# Altium schematic sheet FPGA_GTXs.SchDoc: FPGA GTX Transceivers & SFP Clock
size B; CheckedBy: Jason Sullins; Author: Jordan Harris-Toovy; Revision: 0.2; SheetNumber: 20; SheetTotal: 22; Size: ANSI B
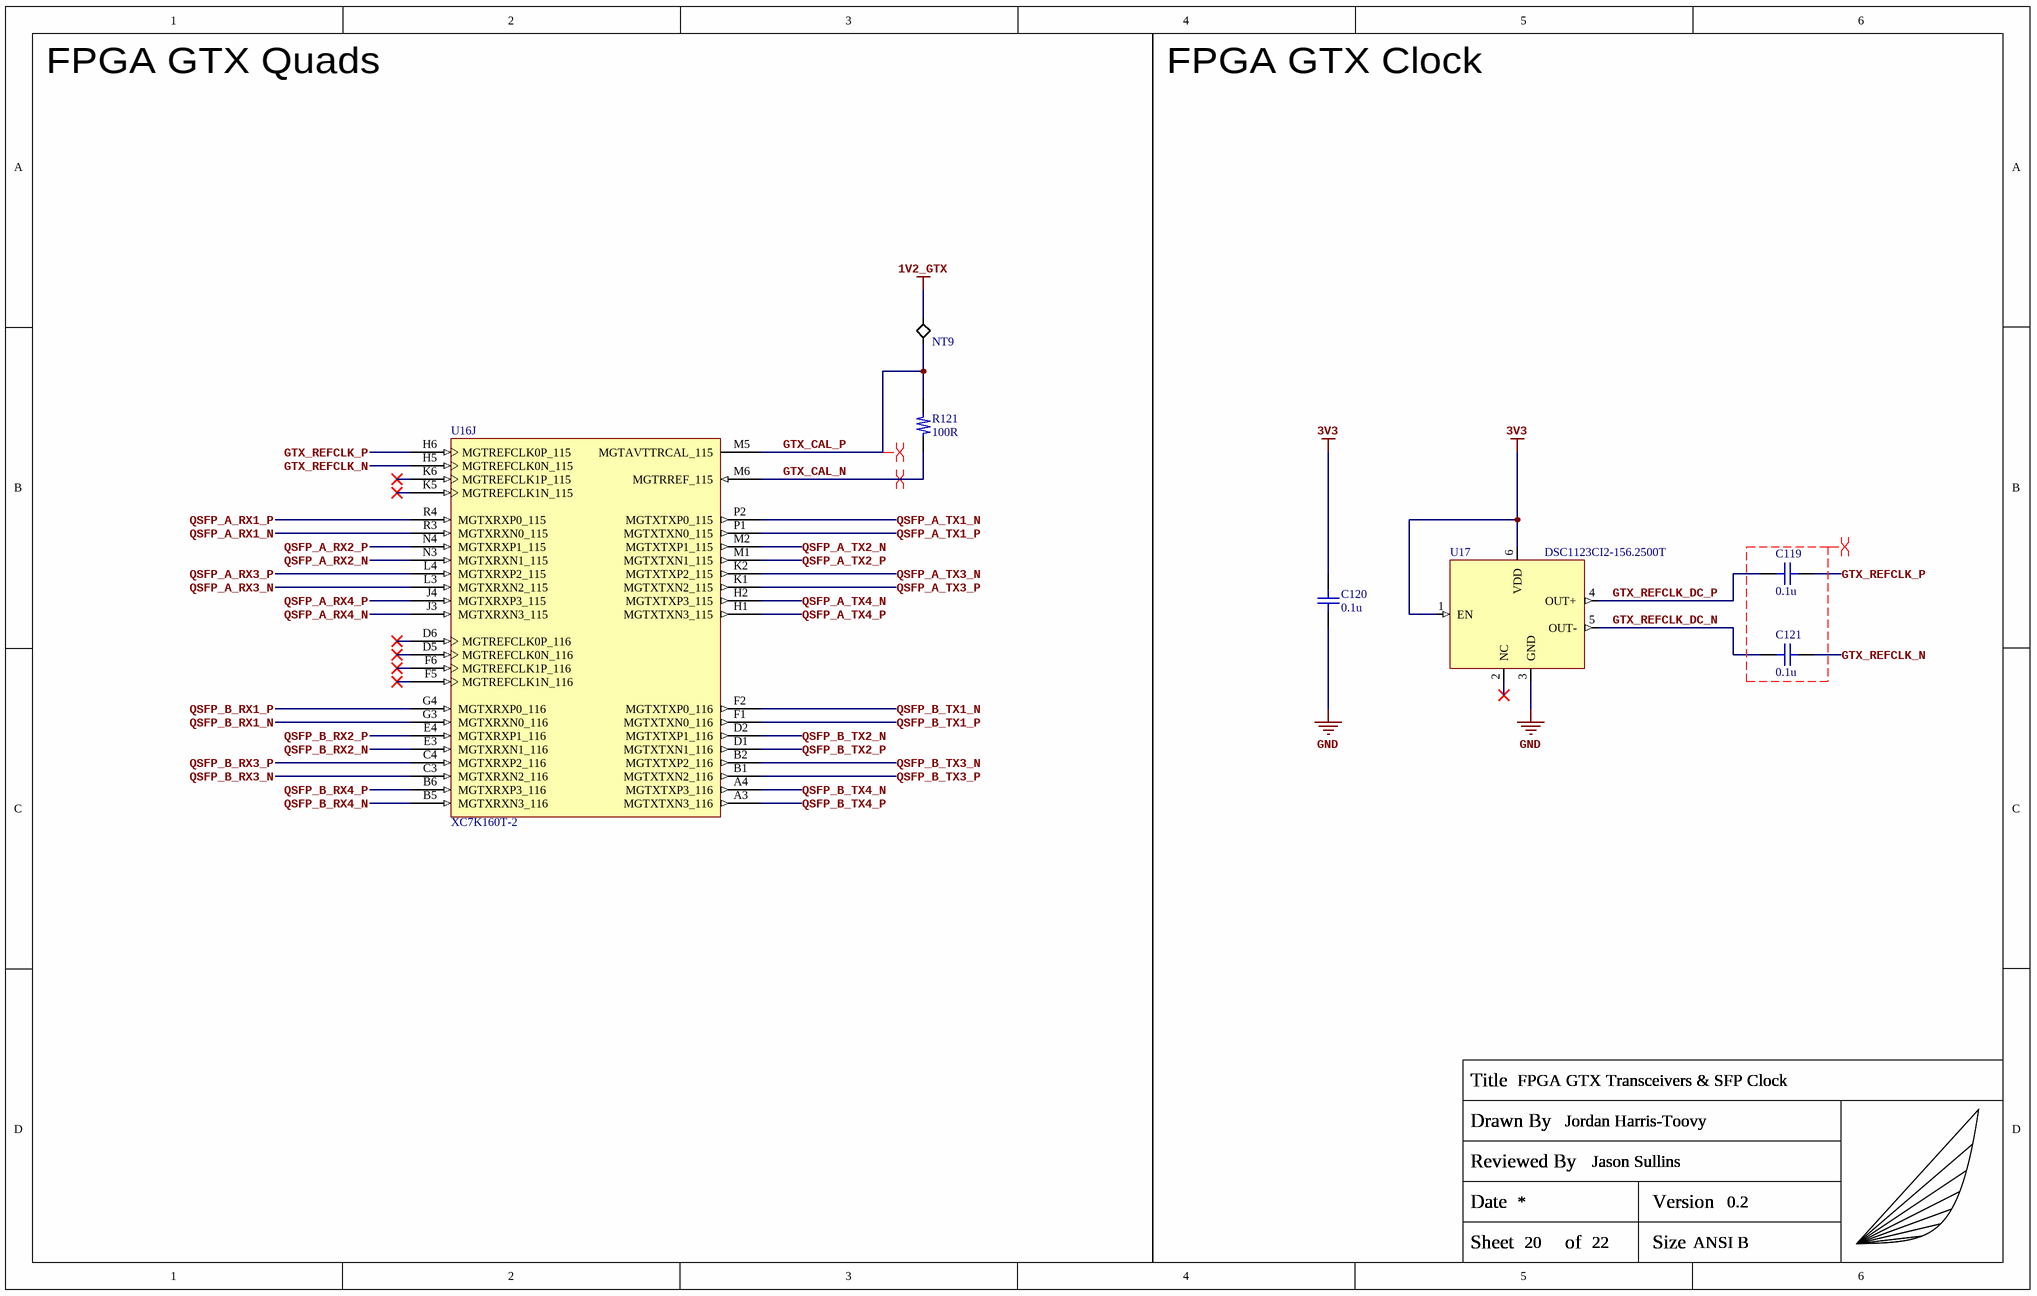
[diagram p0: FPGA_GTXs.SchDoc]

## Parts
C119  0.1u  [C_0402_Generic]
C120  0.1u  [C_0402_Generic]
C121  0.1u  [C_0402_Generic]
NT9  NT  [SMD_NET_TIE]  (value not drawn)  (net tie, no BOM)
R121  100R  [R_0402_Generic]
TITLEBLOCK?  Capstone_Title_Block  (value not drawn)  (graphical)
U16  XC7K160T-2  [FFG676_(XC7K160T-2FFG676I)]  (part J of 14)
U17  DSC1123CI2-156.2500T  [Microchip_DSC1123CI2]

## Nets
1V2_GTX: NT9.2(P2)
3V3: C120.1 U17.1(EN) U17.6(VDD)
GND: C120.2 U17.3(GND)
GTX_CAL_N: R121.1 U16.M6(MGTRREF_115)
GTX_CAL_P: NT9.1(P1) R121.2 U16.M5(MGTAVTTRCAL_115)
GTX_REFCLK_DC_N: C121.2 U17.5(OUT-)
GTX_REFCLK_DC_P: C119.2 U17.4(OUT+)
GTX_REFCLK_N: C121.1 U16.H5(MGTREFCLK0N_115)
GTX_REFCLK_P: C119.1 U16.H6(MGTREFCLK0P_115)
QSFP_A_RX1_N: U16.R3(MGTXRXN0_115)
QSFP_A_RX1_P: U16.R4(MGTXRXP0_115)
QSFP_A_RX2_N: U16.N3(MGTXRXN1_115)
QSFP_A_RX2_P: U16.N4(MGTXRXP1_115)
QSFP_A_RX3_N: U16.L3(MGTXRXN2_115)
QSFP_A_RX3_P: U16.L4(MGTXRXP2_115)
QSFP_A_RX4_N: U16.J3(MGTXRXN3_115)
QSFP_A_RX4_P: U16.J4(MGTXRXP3_115)
QSFP_A_TX1_N: U16.P2(MGTXTXP0_115)
QSFP_A_TX1_P: U16.P1(MGTXTXN0_115)
QSFP_A_TX2_N: U16.M2(MGTXTXP1_115)
QSFP_A_TX2_P: U16.M1(MGTXTXN1_115)
QSFP_A_TX3_N: U16.K2(MGTXTXP2_115)
QSFP_A_TX3_P: U16.K1(MGTXTXN2_115)
QSFP_A_TX4_N: U16.H2(MGTXTXP3_115)
QSFP_A_TX4_P: U16.H1(MGTXTXN3_115)
QSFP_B_RX1_N: U16.G3(MGTXRXN0_116)
QSFP_B_RX1_P: U16.G4(MGTXRXP0_116)
QSFP_B_RX2_N: U16.E3(MGTXRXN1_116)
QSFP_B_RX2_P: U16.E4(MGTXRXP1_116)
QSFP_B_RX3_N: U16.C3(MGTXRXN2_116)
QSFP_B_RX3_P: U16.C4(MGTXRXP2_116)
QSFP_B_RX4_N: U16.B5(MGTXRXN3_116)
QSFP_B_RX4_P: U16.B6(MGTXRXP3_116)
QSFP_B_TX1_N: U16.F2(MGTXTXP0_116)
QSFP_B_TX1_P: U16.F1(MGTXTXN0_116)
QSFP_B_TX2_N: U16.D2(MGTXTXP1_116)
QSFP_B_TX2_P: U16.D1(MGTXTXN1_116)
QSFP_B_TX3_N: U16.B2(MGTXTXP2_116)
QSFP_B_TX3_P: U16.B1(MGTXTXN2_116)
QSFP_B_TX4_N: U16.A4(MGTXTXP3_116)
QSFP_B_TX4_P: U16.A3(MGTXTXN3_116)

Not connected (* = marked no-connect by the designer): U16 D5(MGTREFCLK0N_116)* D6(MGTREFCLK0P_116)* F5(MGTREFCLK1N_116)* F6(MGTREFCLK1P_116)* K5(MGTREFCLK1N_115)* K6(MGTREFCLK1P_115)*; U17 2(NC)*

## Layout directives
differential pair; differential pair class DP100_GENERAL: (no net found under the mark), GTX_CAL_N, GTX_CAL_P

## Notes on the sheet
- FPGA GTX Quads
- FPGA GTX Clock
- (in symbol Capstone_Title_Block) Title; Drawn By; Reviewed By; Date; Version; Sheet; of; Size

## Library data of the parts
C119-C121 = GRM155R71C104KA88D: 0.1µF 16V X7R SMD ceramic capacitor in 0402 size; Manufacturer: Murata Electronics; Manufacturer Part Number: GRM155R71C104KA88D
NT9 = Net_Tie_SMD: SMD Net Tie; Manufacturer: NONE; Manufacturer Part Number: NONE
R121 = ERJ-2RHD1000X: 100Ohm 0.5% 1/16W SMD resistor in 0402 size; Manufacturer: Panasonic; Manufacturer Part Number: ERJ-2RHD1000X
TITLEBLOCK? = Capstone_Title_Block: Custom title block with personal logo; Manufacturer: NONE; Manufacturer Part Number: NONE
U16 = XC7K160T-2FFG676I: Kintex-7 FPGA, 400 User I/Os, 8 GTX, 676-Ball BGA, Speed Grade 2, Industrial Grade, Pb-Free; Manufacturer: AMD/Xilinx; Manufacturer Part Number: XC7K160T-2FFG676I
U17 = DSC1123CI2-156.2500T: MEMS OSC XO 156.2500MHZ LVDS SMD; Manufacturer: Microchip Technology; Manufacturer Part Number: DSC1123CI2-156.2500T